# EAGLE design 131210_AriloRX_0_0 (EAGLE 6.4)
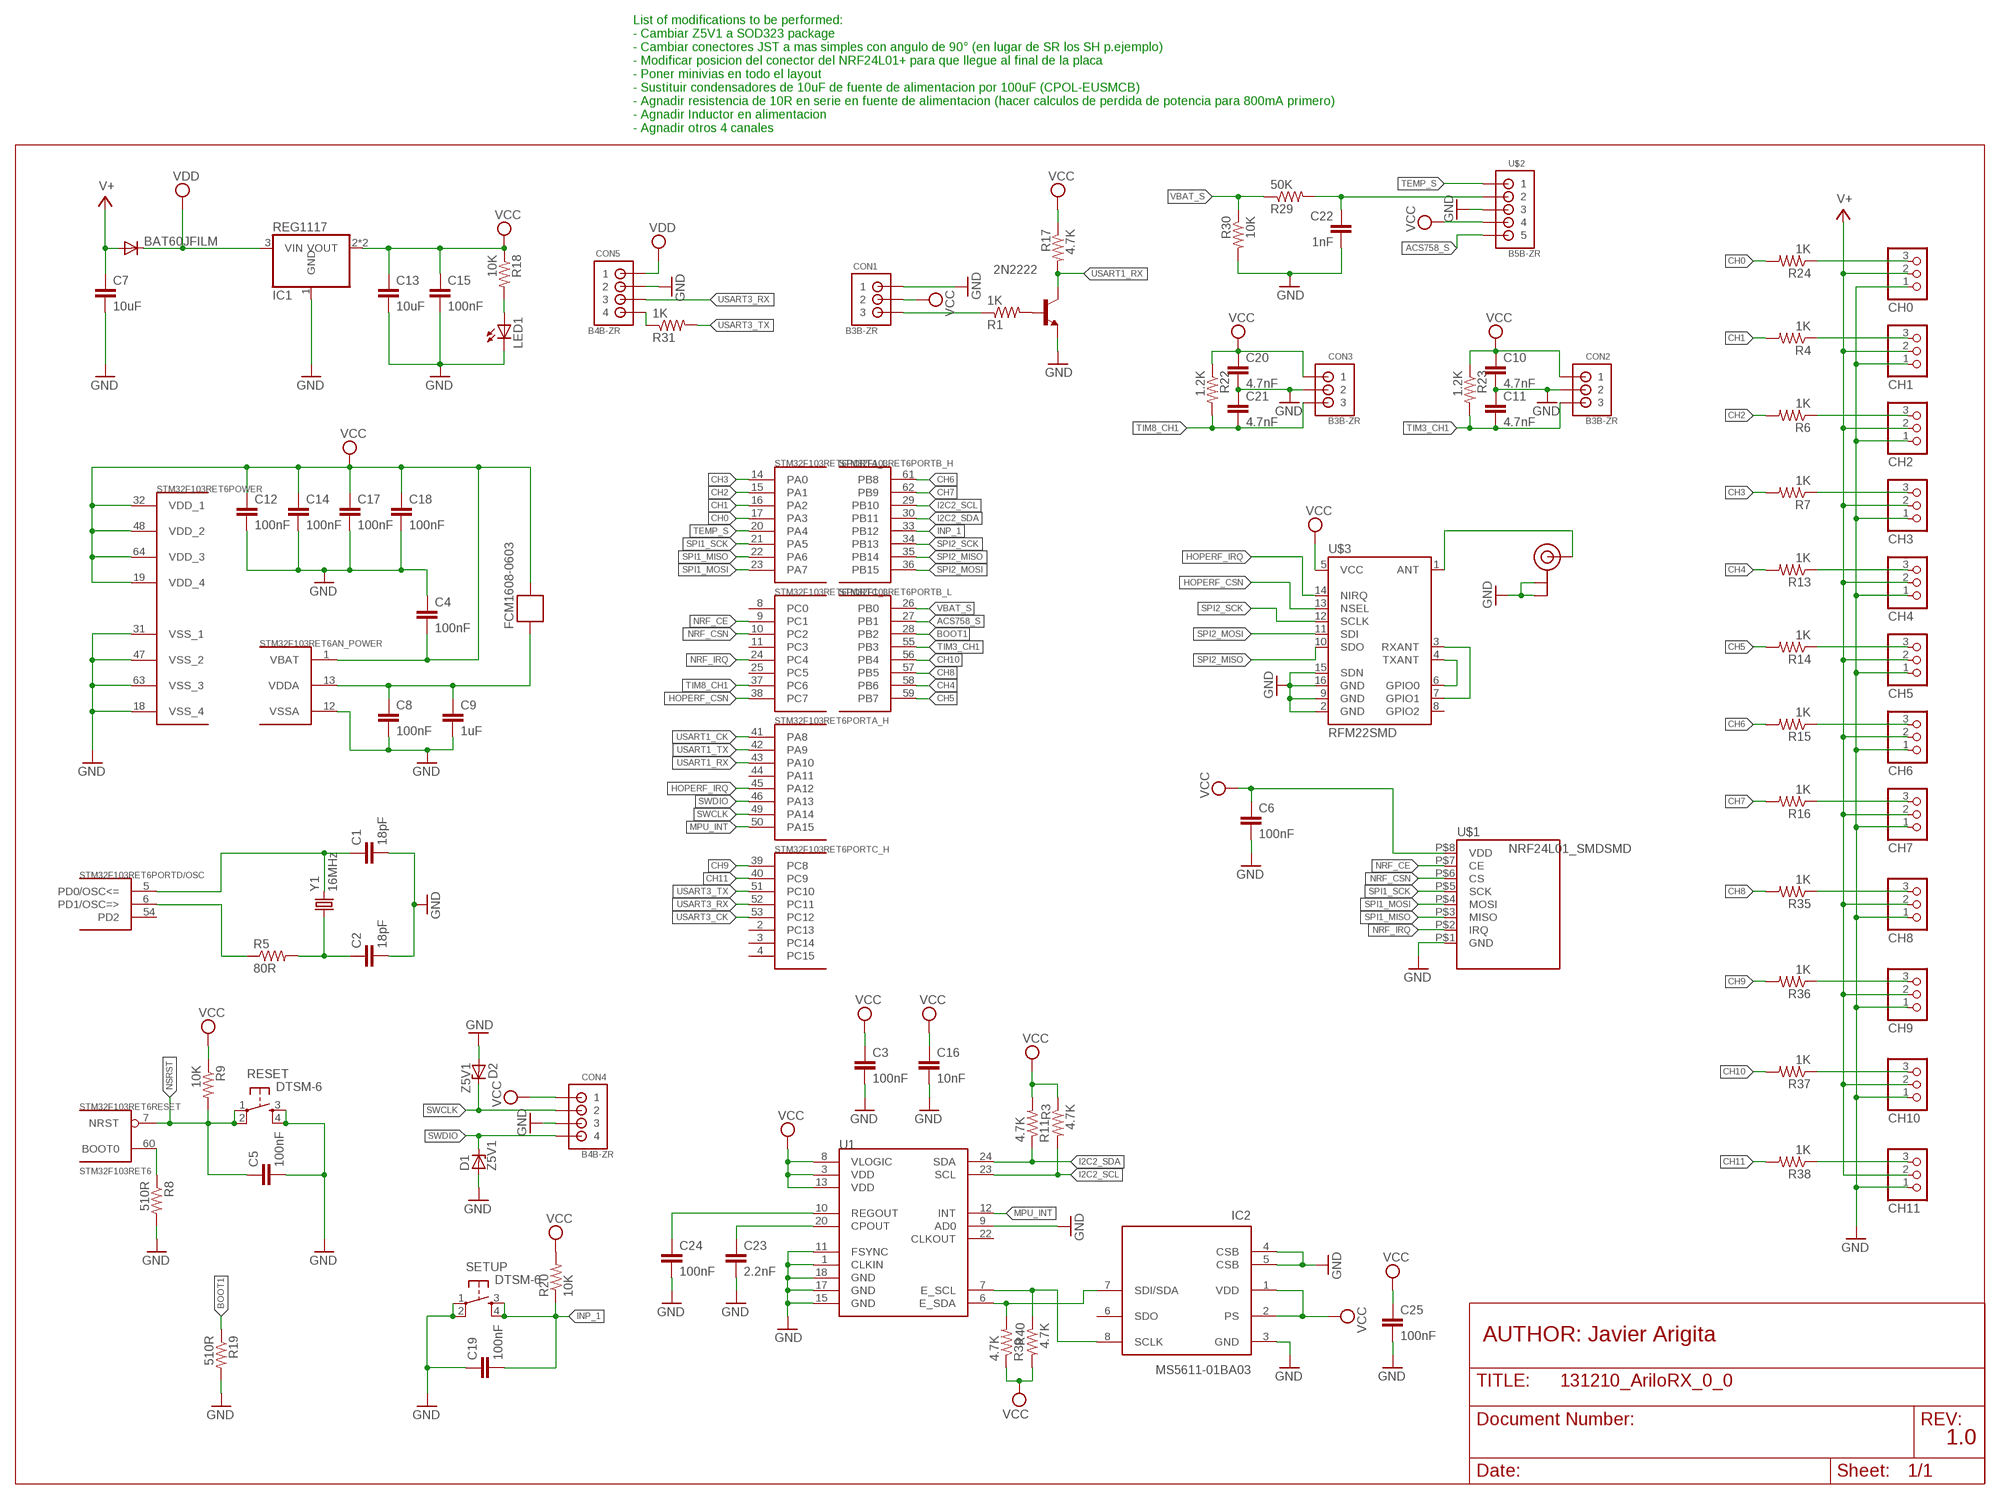
[diagram p0: schematic, sheet 1]

## Parts
2N2222  MMBT2222ALT1-NPN-SOT23-BEC  [SOT23-BEC]
BAT60JFILM  DIODE-SOD323-R  [SOD323-R]
C1  18pF  C-EUC0805  [C0805]
C2  18pF  C-EUC0805  [C0805]
C3  100nF  C-EUC0805  [C0805]
C4  100nF  C-EUC0805  [C0805]
C5  100nF  C-EUC0805  [C0805]
C6  100nF  C-EUC0805  [C0805]
C7  10uF  C-EUC3216  [C3216]
C8  100nF  C-EUC0805  [C0805]
C9  1uF  C-EUC3216  [C3216]
C10  4.7nF  C-EUC0805  [C0805]
C11  4.7nF  C-EUC0805  [C0805]
C12  100nF  C-EUC0805  [C0805]
C13  10uF  C-EUC3216  [C3216]
C14  100nF  C-EUC0805  [C0805]
C15  100nF  C-EUC0805  [C0805]
C16  10nF  C-EUC0805  [C0805]
C17  100nF  C-EUC0805  [C0805]
C18  100nF  C-EUC0805  [C0805]
C19  100nF  C-EUC0805  [C0805]
C20  4.7nF  C-EUC0805  [C0805]
C21  4.7nF  C-EUC0805  [C0805]
C22  1nF  C-EUC0805  [C0805]
C23  2.2nF  C-EUC0805  [C0805]
C24  100nF  C-EUC0805  [C0805]
C25  100nF  C-EUC0805  [C0805]
CH0  PINHD-1X3  [1X03]
CH1  PINHD-1X3  [1X03]
CH2  PINHD-1X3  [1X03]
CH3  PINHD-1X3  [1X03]
CH4  PINHD-1X3  [1X03]
CH5  PINHD-1X3  [1X03]
CH6  PINHD-1X3  [1X03]
CH7  PINHD-1X3  [1X03]
CH8  PINHD-1X3  [1X03]
CH9  PINHD-1X3  [1X03]
CH10  PINHD-1X3  [1X03]
CH11  PINHD-1X3  [1X03]
CON1  B3B-ZR  [B3B-ZR]
CON2  B3B-ZR  [B3B-ZR]
CON3  B3B-ZR  [B3B-ZR]
CON4  B4B-ZR  [B4B-ZR]
CON5  B4B-ZR  [B4B-ZR]
D1  Z5V1  ZENER-DIODESOD80C  [SOD80C]
D2  Z5V1  ZENER-DIODESOD80C  [SOD80C]
FCM1608-0603  FERRITE-BEAD  [R0603]
IC1  REG1117  [SOT223]
IC2  MS5611-01BA03  [SON125P300X500X100-8N]
LED1  LED0805  [CHIPLED_0805]
R1  1K  RESISTOR0805  [R0805]
R3  4.7K  RESISTOR0805  [R0805]
R4  1K  RESISTOR0805  [R0805]
R5  80R  RESISTOR0805  [R0805]
R6  1K  RESISTOR0805  [R0805]
R7  1K  RESISTOR0805  [R0805]
R8  510R  RESISTOR0805  [R0805]
R9  10K  RESISTOR0805  [R0805]
R11  4.7K  RESISTOR0805  [R0805]
R13  1K  RESISTOR0805  [R0805]
R14  1K  RESISTOR0805  [R0805]
R15  1K  RESISTOR0805  [R0805]
R16  1K  RESISTOR0805  [R0805]
R17  4.7K  RESISTOR0805  [R0805]
R18  10K  RESISTOR0805  [R0805]
R19  510R  RESISTOR0805  [R0805]
R20  10K  RESISTOR0805  [R0805]
R22  1.2K  RESISTOR0805  [R0805]
R23  1.2K  RESISTOR0805  [R0805]
R24  1K  RESISTOR0805  [R0805]
R29  50K  RESISTOR0805  [R0805]
R30  10K  RESISTOR0805  [R0805]
R31  1K  RESISTOR0805  [R0805]
R35  1K  RESISTOR0805  [R0805]
R36  1K  RESISTOR0805  [R0805]
R37  1K  RESISTOR0805  [R0805]
R38  1K  RESISTOR0805  [R0805]
R39  4.7K  RESISTOR0805  [R0805]
R40  4.7K  RESISTOR0805  [R0805]
RESET  DTSM-6  [DTSM-6]
SETUP  DTSM-6  [DTSM-6]
STM32F103RET6  STM32F103RET6  STM32F10XRXT6  [TQFP64]
U1  MPU-9150QFN-24-NP  [QFN-24-NP]
U$1  NRF24L01_SMDSMD  [NRF24L01_SMD]
U$2  B5B-ZR  [B5B-ZR]
U$3  RFM22SMD  [RFM22-XXX-S2]
U$4  U.FL  [U.FL]
Y1  16MHz  CRYSTAL5X3  [CRYSTAL-SMD-5X3]

## Nets
ACS758_S: STM32F103RET6.27(PORTB_L:PB1) U$2.5
BOOT1: R19.1 STM32F103RET6.28(PORTB_L:PB2)
CH0: R24.2 STM32F103RET6.17(PORTA_L:PA3)
CH1: R4.2 STM32F103RET6.16(PORTA_L:PA2)
CH2: R6.2 STM32F103RET6.15(PORTA_L:PA1)
CH3: R7.2 STM32F103RET6.14(PORTA_L:PA0)
CH4: R13.2 STM32F103RET6.58(PORTB_L:PB6)
CH5: R14.2 STM32F103RET6.59(PORTB_L:PB7)
CH6: R15.2 STM32F103RET6.61(PORTB_H:PB8)
CH7: R16.2 STM32F103RET6.62(PORTB_H:PB9)
CH8: R35.2 STM32F103RET6.57(PORTB_L:PB5)
CH9: R36.2 STM32F103RET6.39(PORTC_H:PC8)
CH10: R37.2 STM32F103RET6.56(PORTB_L:PB4)
CH11: R38.2 STM32F103RET6.40(PORTC_H:PC9)
GND: 2N2222.E C1.2 C2.2 C3.2 C4.1 C5.2 C6.2 C7.2 C8.2 C9.2 C10.2 C11.1 C12.2 C13.2 C14.2 C15.2 C16.2 C17.2 C18.2 C19.1 C20.2 C21.1 C22.2 C23.2 C24.2 C25.2 CH0.1 CH1.1 CH2.1 CH3.1 CH4.1 CH5.1 CH6.1 CH7.1 CH8.1 CH9.1 CH10.1 CH11.1 CON1.1 CON2.2 CON3.2 CON4.3 CON5.2 D1.A D2.A IC1.1(GND) IC2.3(GND) IC2.4(CSB) IC2.5(CSB) LED1.C R8.2 R19.2 R30.2 RESET.3 RESET.4 SETUP.1 SETUP.2 STM32F103RET6.12(AN_POWER:VSSA) STM32F103RET6.18(POWER:VSS_4) STM32F103RET6.31(POWER:VSS_1) STM32F103RET6.47(POWER:VSS_2) STM32F103RET6.63(POWER:VSS_3) U1.1(CLKIN) U1.9(AD0) U1.11(FSYNC) U1.15(GND) U1.17(GND) U1.18(GND) U$1.P$1(GND) U$2.3 U$3.2(GND) U$3.9(GND) U$3.15(SDN) U$3.16(GND) U$4.P$1(GND) U$4.P$2(GND)
HOPERF_CSN: STM32F103RET6.38(PORTC_L:PC7) U$3.13(NSEL)
HOPERF_IRQ: STM32F103RET6.45(PORTA_H:PA12) U$3.14(NIRQ)
I2C2_SCL: R3.2 STM32F103RET6.29(PORTB_H:PB10) U1.23(SCL)
I2C2_SDA: R11.1 STM32F103RET6.30(PORTB_H:PB11) U1.24(SDA)
INP_1: C19.2 R20.1 SETUP.3 SETUP.4 STM32F103RET6.33(PORTB_H:PB12)
MPU_INT: STM32F103RET6.50(PORTA_H:PA15) U1.12(INT)
N$1: C1.1 STM32F103RET6.5(PORTD/OSC:PD0/OSC<=) Y1.3
N$2: R5.1 STM32F103RET6.6(PORTD/OSC:PD1/OSC=>)
N$3: C2.1 R5.2 Y1.1
N$4: R8.1 STM32F103RET6.60(RESET:BOOT0)
N$5: U$3.3(RXANT) U$3.7(GPIO1)
N$6: U$3.4(TXANT) U$3.6(GPIO0)
N$7: U$3.1(ANT) U$4.P$3(SIGNAL)
N$9: CH0.3 R24.1
N$10: LED1.A R18.2
N$11: CON5.4 R31.1
N$13: CH8.3 R35.1
N$14: CON1.3 R1.1
N$15: C22.1 R29.2 U$2.2
N$16: 2N2222.B R1.2
N$17: C8.1 C9.1 FCM1608-0603.2 STM32F103RET6.13(AN_POWER:VDDA)
N$21: CH2.3 R6.1
N$23: CH4.3 R13.1
N$25: CH9.3 R36.1
N$26: CH10.3 R37.1
N$27: CH11.3 R38.1
N$28: IC2.8(SCLK) R40.1 U1.7(E_SCL)
N$29: IC2.7(SDI/SDA) R39.2 U1.6(E_SDA)
N$31: CH3.3 R7.1
N$32: CH6.3 R15.1
N$33: C23.1 U1.20(CPOUT)
N$34: CH5.3 R14.1
N$35: CH7.3 R16.1
N$40: C24.1 U1.10(REGOUT)
N$53: CH1.3 R4.1
NRF_CE: STM32F103RET6.9(PORTC_L:PC1) U$1.P$7(CE)
NRF_CSN: STM32F103RET6.10(PORTC_L:PC2) U$1.P$6(CS)
NRF_IRQ: STM32F103RET6.24(PORTC_L:PC4) U$1.P$2(IRQ)
NSRST: C5.1 R9.2 RESET.1 RESET.2 STM32F103RET6.7(RESET:NRST)
SPI1_MISO: STM32F103RET6.22(PORTA_L:PA6) U$1.P$3(MISO)
SPI1_MOSI: STM32F103RET6.23(PORTA_L:PA7) U$1.P$4(MOSI)
SPI1_SCK: STM32F103RET6.21(PORTA_L:PA5) U$1.P$5(SCK)
SPI2_MISO: STM32F103RET6.35(PORTB_H:PB14) U$3.10(SDO)
SPI2_MOSI: STM32F103RET6.36(PORTB_H:PB15) U$3.11(SDI)
SPI2_SCK: STM32F103RET6.34(PORTB_H:PB13) U$3.12(SCLK)
SWCLK: CON4.2 D2.C STM32F103RET6.49(PORTA_H:PA14)
SWDIO: CON4.4 D1.C STM32F103RET6.46(PORTA_H:PA13)
TEMP_S: STM32F103RET6.20(PORTA_L:PA4) U$2.1
TIM3_CH1: C11.2 CON2.3 R23.2 STM32F103RET6.55(PORTB_L:PB3)
TIM8_CH1: C21.2 CON3.3 R22.2 STM32F103RET6.37(PORTC_L:PC6)
USART1_CK: STM32F103RET6.41(PORTA_H:PA8)
USART1_RX: 2N2222.C R17.2 STM32F103RET6.43(PORTA_H:PA10)
USART1_TX: STM32F103RET6.42(PORTA_H:PA9)
USART3_CK: STM32F103RET6.53(PORTC_H:PC12)
USART3_RX: CON5.3 STM32F103RET6.52(PORTC_H:PC11)
USART3_TX: R31.2 STM32F103RET6.51(PORTC_H:PC10)
V+: BAT60JFILM.A C7.1 CH0.2 CH1.2 CH2.2 CH3.2 CH4.2 CH5.2 CH6.2 CH7.2 CH8.2 CH9.2 CH10.2 CH11.2
VBAT_S: R29.1 R30.1 STM32F103RET6.26(PORTB_L:PB0)
VCC: C3.1 C4.2 C6.1 C10.1 C12.1 C13.1 C14.1 C15.1 C16.1 C17.1 C18.1 C20.1 C25.1 CON1.2 CON2.1 CON3.1 CON4.1 FCM1608-0603.1 IC1.2(VOUT) IC1.4(VOUT) IC2.1(VDD) IC2.2(PS) R3.1 R9.1 R11.2 R17.1 R18.1 R20.2 R22.1 R23.1 R39.1 R40.2 STM32F103RET6.1(AN_POWER:VBAT) STM32F103RET6.19(POWER:VDD_4) STM32F103RET6.32(POWER:VDD_1) STM32F103RET6.48(POWER:VDD_2) STM32F103RET6.64(POWER:VDD_3) U1.3(VDD) U1.8(VLOGIC) U1.13(VDD) U$1.P$8(VDD) U$2.4 U$3.5(VCC)
VDD: BAT60JFILM.C CON5.1 IC1.3(VIN)
Unconnected: IC2.6(SDO) STM32F103RET6.2(PORTC_H:PC13) STM32F103RET6.3(PORTC_H:PC14) STM32F103RET6.4(PORTC_H:PC15) STM32F103RET6.8(PORTC_L:PC0) STM32F103RET6.11(PORTC_L:PC3) STM32F103RET6.25(PORTC_L:PC5) STM32F103RET6.44(PORTA_H:PA11) STM32F103RET6.54(PORTD/OSC:PD2) U1.22(CLKOUT) U$3.8(GPIO2)

## Notes on the sheet
- List of modifications to be performed:
  - Cambiar Z5V1 a SOD323 package
  - Cambiar conectores JST a mas simples con angulo de 90° (en lugar de SR los SH p.ejemplo)
  - Modificar posicion del conector del NRF24L01+ para que llegue al final de la placa
  - Poner minivias en todo el layout
  - Sustituir condensadores de 10uF de fuente de alimentacion por 100uF (CPOL-EUSMCB)
  - Agnadir resistencia de 10R en serie en fuente de alimentacion (hacer calculos de perdida de potencia para 800mA primero)
  - Agnadir Inductor en alimentacion
  - Agnadir otros 4 canales
- AUTHOR: Javier Arigita
- 1.0

## Library data of the parts
2N2222 = transistor:*-NPN-: NPN Transistror BF959 corrected 2008.03.06
BAT60JFILM = diode:DIODE-: DIODE
C1-C6 C8 C10-C12 C14-C25 = rcl:C-EU: CAPACITOR, European symbol
C7 C9 C13 = resistor:C-EU: CAPACITOR, European symbol
CH0 CH1-CH11 = pinhead_rc:PINHD-1X3: PIN HEADER
CON1-CON3 = jst:B3B-ZR: JST-ZH Connector 3 pol, 1.5mm pitch Package: B3B-ZR Source: http://www.jst-mfg.com/product/pdf/eng/eZH.pdf
CON4 CON5 = jst:B4B-ZR: JST-ZH Connector 4 pol, 1.5mm pitch Package: B4B-ZR Source: http://www.jst-mfg.com/product/pdf/eng/eZH.pdf
D1 D2 = diode:ZENER-DIODE: Z-Diode
FCM1608-0603 = BaseApp:FERRITE-BEAD
IC1 = CEDT:REG1117: 800mA and 1A Low Dropout (LDO) Positive Regulator 1.8V, 2.5V, 2.85V, 3.3V, 5V, and Adj
IC2 = Measurement-Specialties:MS5611-01BA03: Variometer Module, with stainless steel cap
LED1 = CEDT:LED
R1 R3-R9 R11 R13-R20 R22-R24 R29-R31 R35-R40 = CEDT:RESISTOR
RESET SETUP = switch-tact:DTSM-6
STM32F103RET6 = stm32:STM32F10XRXT6: STM32F101/103 64pin LQFP
U1 = SparkFun-Sensors:MPU-9150: 9DOF (3mag, 3accel, 3rotat). I2C interface.
U$1 = NRF24L01+:NRF24L01_SMD
U$2 = jst:B5B-ZR: JST-ZH Connector 5 pol, 1.5mm pitch Package: B5B-ZR Source: http://www.jst-mfg.com/product/pdf/eng/eZH.pdf
U$3 = SparkFun-RF:RFM22: The RFM22 is a low-power, low cost radio that is capable of operating in the 434MHz and 900MHz open bands. It's frequency is software defined and there are some very good libraries written for it.
U$4 = SparkFun-Connectors:U.FL: SMD antenna connector- WRL-09144
Y1 = SparkFun-FreqCtrl:CRYSTAL: Various standard crystals. Proven footprints. Spark Fun Electronics SKU : COM-00534

## Board
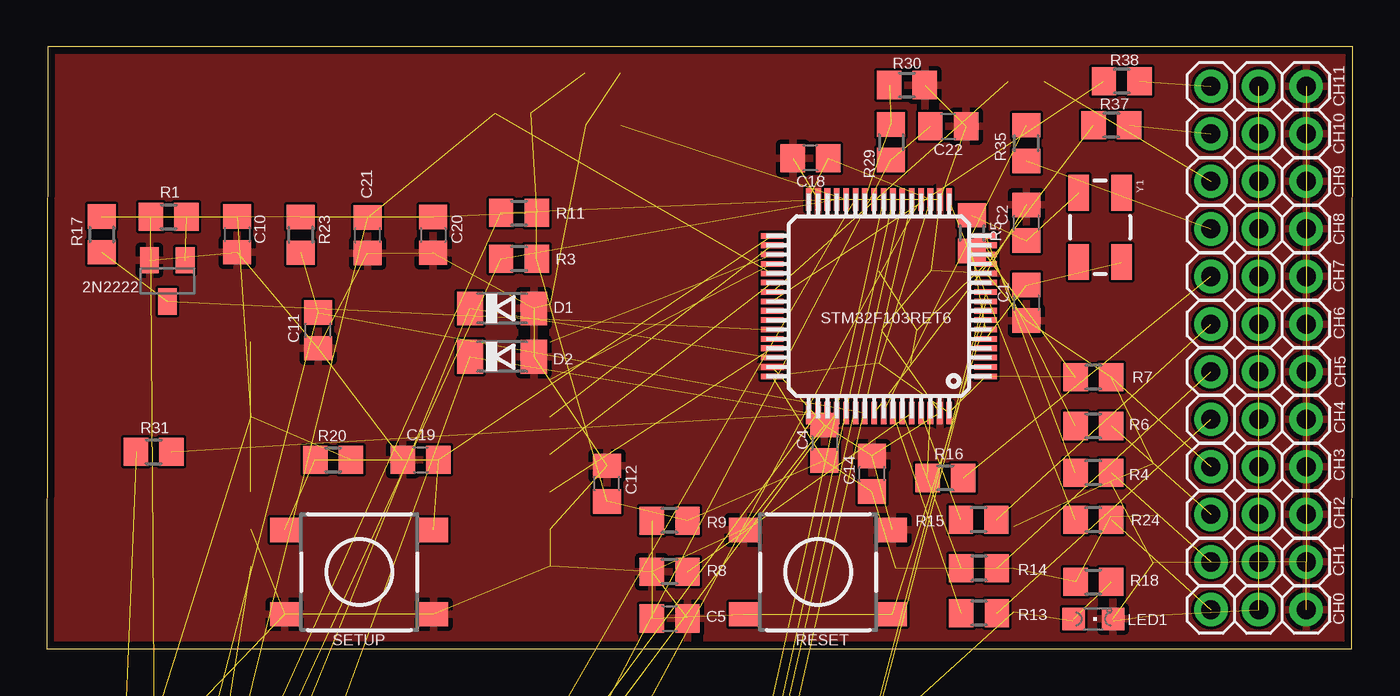
[diagram p1: board, top side]
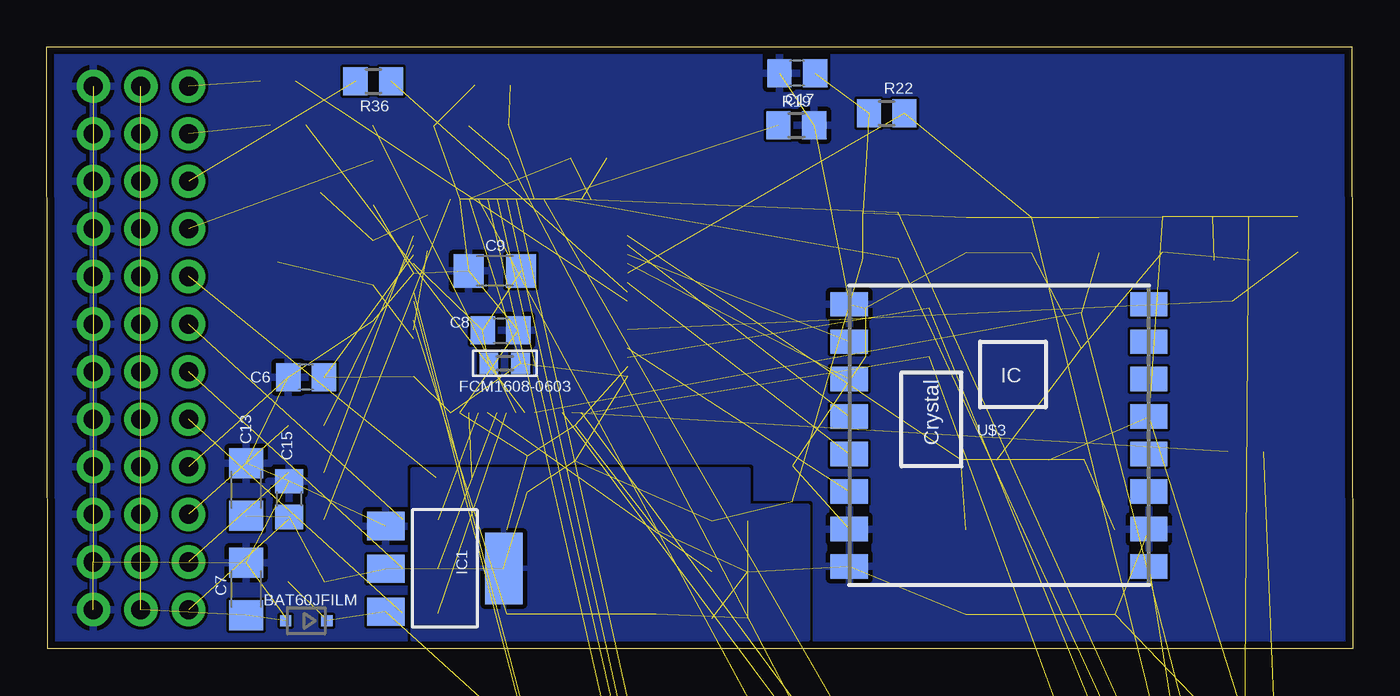
[diagram p2: board, bottom side, seen from below]

Size 69.73 x 32.14 mm. Coordinates in mm from the lower left corner, seen from the top.
Outline: 0,0 69.69,0 69.73,32.14 0.05,32.14 0,0
Copper layers (1*16): Top 0.0356mm / dielectric 1.5011mm / Bottom 0.0356mm
Design rules "default": minimum track width 6mil, minimum drill 13mil, track to track 6mil, track to pad 6mil, pad to pad 6mil, via to via 6mil, smd to smd 6mil, copper to edge 15mil, drill to drill 6mil, minimum pad ring 7mil, minimum via ring 7mil, stop-mask expansion 4mil, vias tented up to drill 0mil, thermal gap 10mil

### Footprints (pad centres in the part's own frame; a part is rotated, then mirrored left to right if it is on the bottom)
SOT23-BEC = smd 1 x 1.4: B -0.95,-1.1; C 0,1.1; E 0.95,-1.1
SOD323-R = smd 0.6 x 0.6: A 1.1,0; C -1.1,0
C0805 = smd 1.3 x 1.5: 1 -0.95,0; 2 0.95,0
C3216 = smd 1.6 x 1.8: 1 -1.4,0; 2 1.4,0
1X03 = drill 1.016 pad 1.778: 1 -2.54,0; 2 0,0; 3 2.54,0
B3B-ZR = drill 0.7 pad 1.1: 1 -1.5,0; 2 0,0; 3 1.5,0
B4B-ZR = drill 0.7: 1 6,-1.3; 2 4.5,-1.3; 3 3,-1.3; 4 1.5,-1.3
SOD80C = smd 1.4 x 1.8: A 1.7,0; C -1.7,0
R0603 = smd 1 x 1.1: 1 -0.85,0; 2 0.85,0
SOT223 = smd 1.499 x 2.007: 1 -2.261,-3.15; 2 0.025,-3.15; 3 2.311,-3.15 | smd 3.81 x 2.007: 4 0,3.15
SON125P300X500X100-8N = smd 1.35 x 0.55: 1 -1.2,1.875; 2 -1.2,0.625; 3 -1.2,-0.625; 4 -1.2,-1.875; 5 1.2,-1.875; 6 1.2,-0.625; 7 1.2,0.625; 8 1.2,1.875
CHIPLED_0805 = smd 1.2 x 1.2: A 0,-1.05; C 0,1.05
R0805 = smd 1.3 x 1.5: 1 -0.95,0; 2 0.95,0
DTSM-6 = smd 1.55 x 1.3: 1 -3.975,2.25; 2 3.975,2.25; 3 -3.975,-2.25; 4 3.975,-2.25
TQFP64 = smd 1.2 x 0.3: 1 -5.7,3.75; 2 -5.7,3.25; 3 -5.7,2.75; 4 -5.7,2.25; 5 -5.7,1.75; 6 -5.7,1.25; 7 -5.7,0.75; 8 -5.7,0.25; 9 -5.7,-0.25; 10 -5.7,-0.75; 11 -5.7,-1.25; 12 -5.7,-1.75; 13 -5.7,-2.25; 14 -5.7,-2.75; 15 -5.7,-3.25; 16 -5.7,-3.75; 33 5.7,-3.75; 34 5.7,-3.25; 35 5.7,-2.75; 36 5.7,-2.25; 37 5.7,-1.75; 38 5.7,-1.25; 39 5.7,-0.75; 40 5.7,-0.25; 41 5.7,0.25; 42 5.7,0.75; 43 5.7,1.25; 44 5.7,1.75; 45 5.7,2.25; 46 5.7,2.75; 47 5.7,3.25; 48 5.7,3.75 | smd 0.3 x 1.2: 17 -3.75,-5.7; 18 -3.25,-5.7; 19 -2.75,-5.7; 20 -2.25,-5.7; 21 -1.75,-5.7; 22 -1.25,-5.7; 23 -0.75,-5.7; 24 -0.25,-5.7; 25 0.25,-5.7; 26 0.75,-5.7; 27 1.25,-5.7; 28 1.75,-5.7; 29 2.25,-5.7; 30 2.75,-5.7; 31 3.25,-5.7; 32 3.75,-5.7; 49 3.75,5.7; 50 3.25,5.7; 51 2.75,5.7; 52 2.25,5.7; 53 1.75,5.7; 54 1.25,5.7; 55 0.75,5.7; 56 0.25,5.7; 57 -0.25,5.7; 58 -0.75,5.7; 59 -1.25,5.7; 60 -1.75,5.7; 61 -2.25,5.7; 62 -2.75,5.7; 63 -3.25,5.7; 64 -3.75,5.7
QFN-24-NP = smd 0.8 x 0.3: 1 -2,1.25; 2 -2,0.75; 3 -2,0.25; 4 -2,-0.25; 5 -2,-0.75; 6 -2,-1.25; 13 2,-1.25; 14 2,-0.75; 15 2,-0.25; 16 2,0.25; 17 2,0.75; 18 2,1.25 | smd 0.3 x 0.8: 7 -1.25,-2; 8 -0.75,-2; 9 -0.25,-2; 10 0.25,-2; 11 0.75,-2; 12 1.25,-2; 19 1.25,2; 20 0.75,2; 21 0.25,2; 22 -0.25,2; 23 -0.75,2; 24 -1.25,2
NRF24L01_SMD = smd 1.27 x 0.635: P$1 26.807,10.492; P$2 26.807,9.222; P$3 26.807,7.952; P$4 26.807,6.682; P$5 26.807,5.412; P$6 26.807,4.142; P$7 26.807,2.872; P$8 26.807,1.602 | smd 0.635 x 1.27: P$9 5.267,0.032; P$11 5.267,-0.018; P$13 5.267,12.032
B5B-ZR = drill 0.7: 1 7.5,-1.3; 2 6,-1.3; 3 4.5,-1.3; 4 3,-1.3; 5 1.5,-1.3
RFM22-XXX-S2 = smd 2 x 1.3: 1 -8,7; 2 -8,5; 3 -8,3; 4 -8,1; 5 -8,-1; 6 -8,-3; 7 -8,-5; 8 -8,-7; 9 8,-7; 10 8,-5; 11 8,-3; 12 8,-1; 13 8,1; 14 8,3; 15 8,5; 16 8,7
U.FL = smd 2.2 x 0.85: P$1 0,1.375; P$2 0,-1.375 | smd 1.05 x 1: P$3 1.525,0; P$4 -1.525,0
CRYSTAL-SMD-5X3 = smd 1.9 x 1.1: 1 -1.85,-1.15; 2 1.85,-1.15; 3 1.85,1.15; 4 -1.85,1.15

### Placement (x,y rotation side)
2N2222  6.43,19.65 180 top
BAT60JFILM  55.88,1.5 180 bottom
C1  52.31,18.48 270 top
C2  52.31,22.75 90 top
C3  -5.8,-53.55 0 top  (outside the outline)
C4  41.53,11 270 top
C5  33.26,1.62 0 top
C6  55.88,14.5 180 bottom
C7  59.09,3.2 90 bottom
C8  45.51,17 0 bottom
C9  45.81,20.18 180 bottom
C10  10.16,22.12 270 top
C11  14.48,17 90 top
C12  29.91,8.82 90 top
C13  59.09,8.5 90 bottom
C14  44.06,9.35 90 top
C15  56.78,8 90 bottom
C16  -5.8,-59.6 0 top  (outside the outline)
C17  29.66,30.73 180 bottom
C18  40.78,26.2 180 top
C19  19.96,10.1 0 top
C20  20.64,22.1 270 top
C21  17.14,22.07 90 top
C22  48.13,27.9 0 top
C23  -10.6,-77.75 0 top  (outside the outline)
C24  -10.6,-83.8 0 top  (outside the outline)
C25  -10.6,-89.85 0 top  (outside the outline)
CH0  64.71,2.1 180 top
CH1  64.71,4.64 180 top
CH2  64.71,7.18 180 top
CH3  64.71,9.72 180 top
CH4  64.71,12.26 180 top
CH5  64.71,14.8 180 top
CH6  64.71,17.34 180 top
CH7  64.71,19.88 180 top
CH8  64.71,22.42 180 top
CH9  64.71,24.96 180 top
CH10  64.71,27.5 180 top
CH11  64.71,30.04 180 top
CON1  4.3,-8.5 0 top  (outside the outline)
CON2  4.3,-15.75 0 top  (outside the outline)
CON3  4.3,-23 0 top  (outside the outline)
CON4  1.3,-29 0 top  (outside the outline)
CON5  1.3,-36.85 0 top  (outside the outline)
D1  24.31,18.18 0 top
D2  24.31,15.6 0 top
FCM1608-0603  45.28,15.25 180 bottom
IC1  48.48,4.3 270 bottom
IC2  -10,-59.85 0 top  (outside the outline)
LED1  55.88,1.6 270 top
R1  6.51,23.07 0 top
R3  25.21,20.82 180 top
R4  55.88,9.4 180 top
R5  49.41,22.2 90 top
R6  55.88,11.9 180 top
R7  55.88,14.5 180 top
R8  33.26,4.12 180 top
R9  33.26,6.85 180 top
R11  25.21,23.27 0 top
R13  49.78,1.9 180 top
R14  49.78,4.3 180 top
R15  49.76,6.9 180 top
R16  47.98,9.12 180 top
R17  2.94,22.12 270 top
R18  55.88,3.58 0 top
R19  29.71,27.95 0 bottom
R20  15.29,10.1 0 top
R22  24.89,28.6 0 bottom
R23  13.56,22.1 270 top
R24  55.88,6.9 180 top
R29  45.09,27.05 270 top
R30  45.94,30.1 0 top
R31  5.71,10.53 0 top
R35  52.31,27 90 top
R36  52.3,30.3 0 bottom
R37  56.85,27.95 180 top
R38  57.4,30.3 180 top
R39  -10.6,-65.65 0 top  (outside the outline)
R40  -10.6,-71.7 0 top  (outside the outline)
RESET  41.19,4.1 180 top
SETUP  16.68,4.1 180 top
STM32F103RET6  44.44,18.3 180 top
U1  -4.85,-45.9 0 top  (outside the outline)
U$1  -12.45,-121.35 0 top  (outside the outline)
U$2  1.3,-44.7 0 top  (outside the outline)
U$3  18.89,11.4 180 bottom
U$4  -11.3,-124.45 0 top  (outside the outline)
Y1  56.25,22.5 270 top

### Tracks (layer width: path | path; a pad name or v marks a point on that pad's centre or on a via)
ACS758_S  (1 unrouted)
BOOT1  (1 unrouted)
CH0  (1 unrouted)
CH1  (1 unrouted)
CH2  (1 unrouted)
CH3  (1 unrouted)
CH4  (1 unrouted)
CH5  (1 unrouted)
CH6  (1 unrouted)
CH7  (1 unrouted)
CH8  (1 unrouted)
CH9  (1 unrouted)
CH10  (1 unrouted)
CH11  (1 unrouted)
GND  (75 unrouted)
  pour Bottom (rank 2): 0.48,31.64 69.19,31.64 69.19,0.5 0.48,0.5
  pour Top: 0.48,31.64 69.19,31.64 69.19,0.5 0.48,0.5
HOPERF_CSN  (1 unrouted)
HOPERF_IRQ  (1 unrouted)
I2C2_SCL  (2 unrouted)
I2C2_SDA  (2 unrouted)
INP_1  (4 unrouted)
MPU_INT  (1 unrouted)
N$1  (2 unrouted)
N$2  (1 unrouted)
N$3  (2 unrouted)
N$4  (1 unrouted)
N$5  (1 unrouted)
N$6  (1 unrouted)
N$7  (1 unrouted)
N$9  (1 unrouted)
N$10  (1 unrouted)
N$11  (1 unrouted)
N$13  (1 unrouted)
N$14  (1 unrouted)
N$15  (2 unrouted)
N$16  (1 unrouted)
N$17  (3 unrouted)
N$21  (1 unrouted)
N$23  (1 unrouted)
N$25  (1 unrouted)
N$26  (1 unrouted)
N$27  (1 unrouted)
N$28  (2 unrouted)
N$29  (2 unrouted)
N$31  (1 unrouted)
N$32  (1 unrouted)
N$33  (1 unrouted)
N$34  (1 unrouted)
N$35  (1 unrouted)
N$40  (1 unrouted)
N$53  (1 unrouted)
NRF_CE  (1 unrouted)
NRF_CSN  (1 unrouted)
NRF_IRQ  (1 unrouted)
NSRST  (4 unrouted)
SPI1_MISO  (1 unrouted)
SPI1_MOSI  (1 unrouted)
SPI1_SCK  (1 unrouted)
SPI2_MISO  (1 unrouted)
SPI2_MOSI  (1 unrouted)
SPI2_SCK  (1 unrouted)
SWCLK  (2 unrouted)
SWDIO  (2 unrouted)
TEMP_S  (1 unrouted)
TIM3_CH1  (3 unrouted)
TIM8_CH1  (3 unrouted)
USART1_RX  (2 unrouted)
USART3_RX  (1 unrouted)
USART3_TX  (1 unrouted)
V+  (13 unrouted)
VBAT_S  (2 unrouted)
VCC  (42 unrouted)
  pour Bottom (isolate 0.305): 29.11,7.62 29.11,0.53 50.19,0.53 50.19,9.57 32.28,9.57 32.28,7.62
VDD  (2 unrouted)

### Text on the board
bPlace: AriloRX | (c) J.ARIGITA